# EasyEDA Pro project 四合一.epro, board PCB2
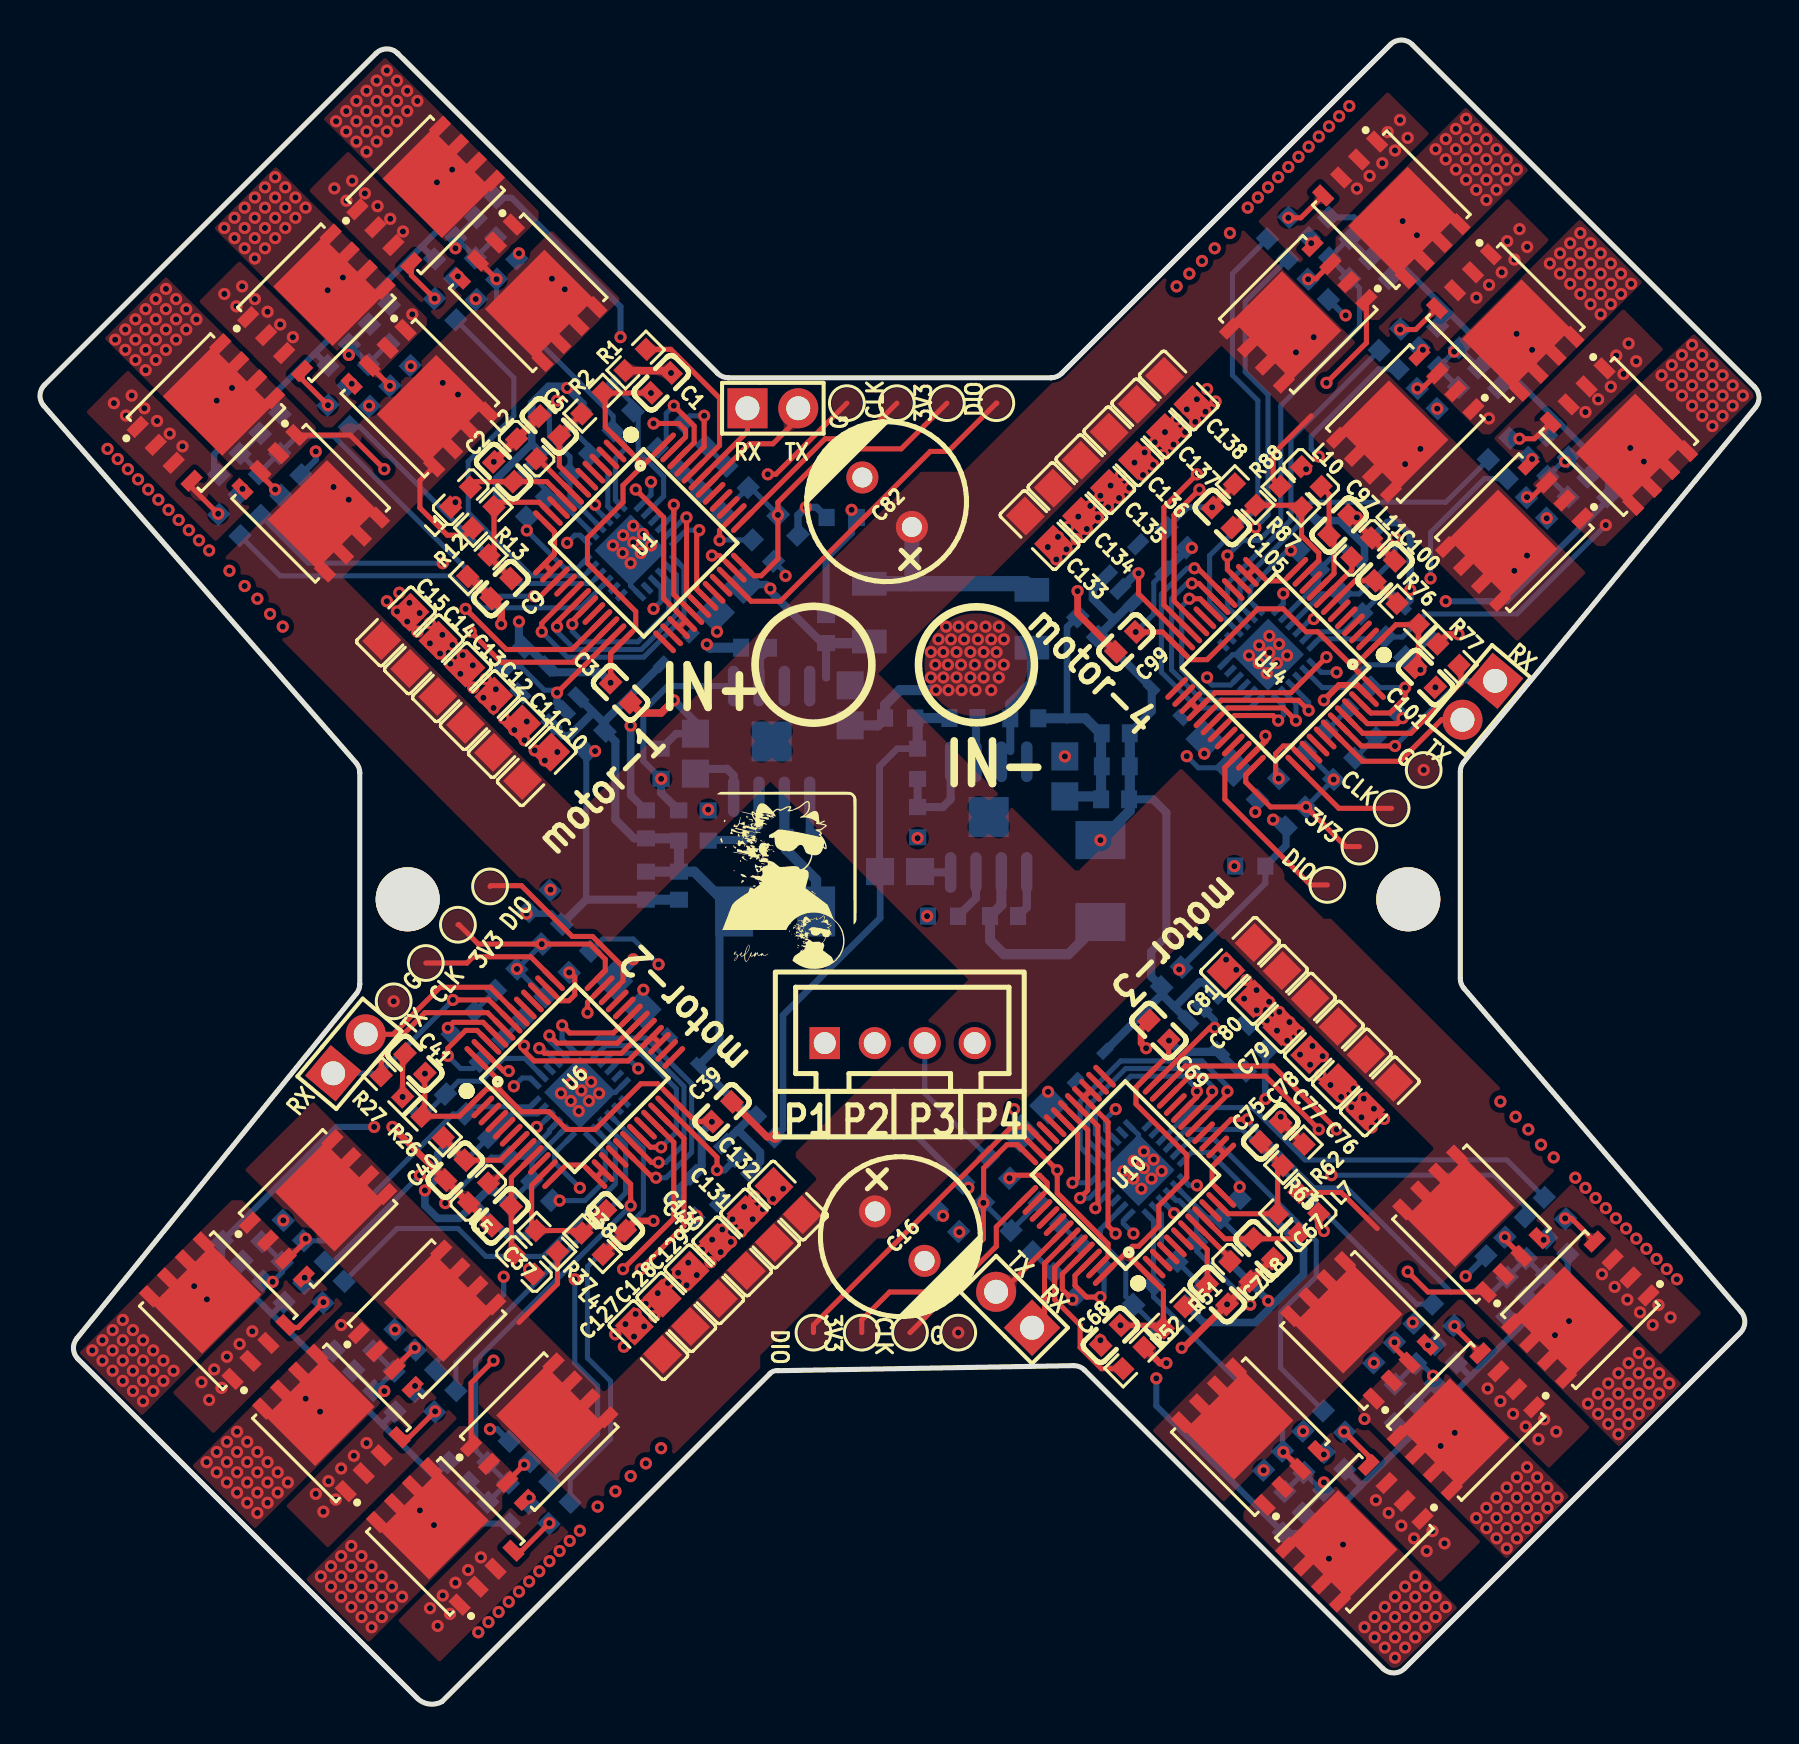
[diagram p5: board, top side]
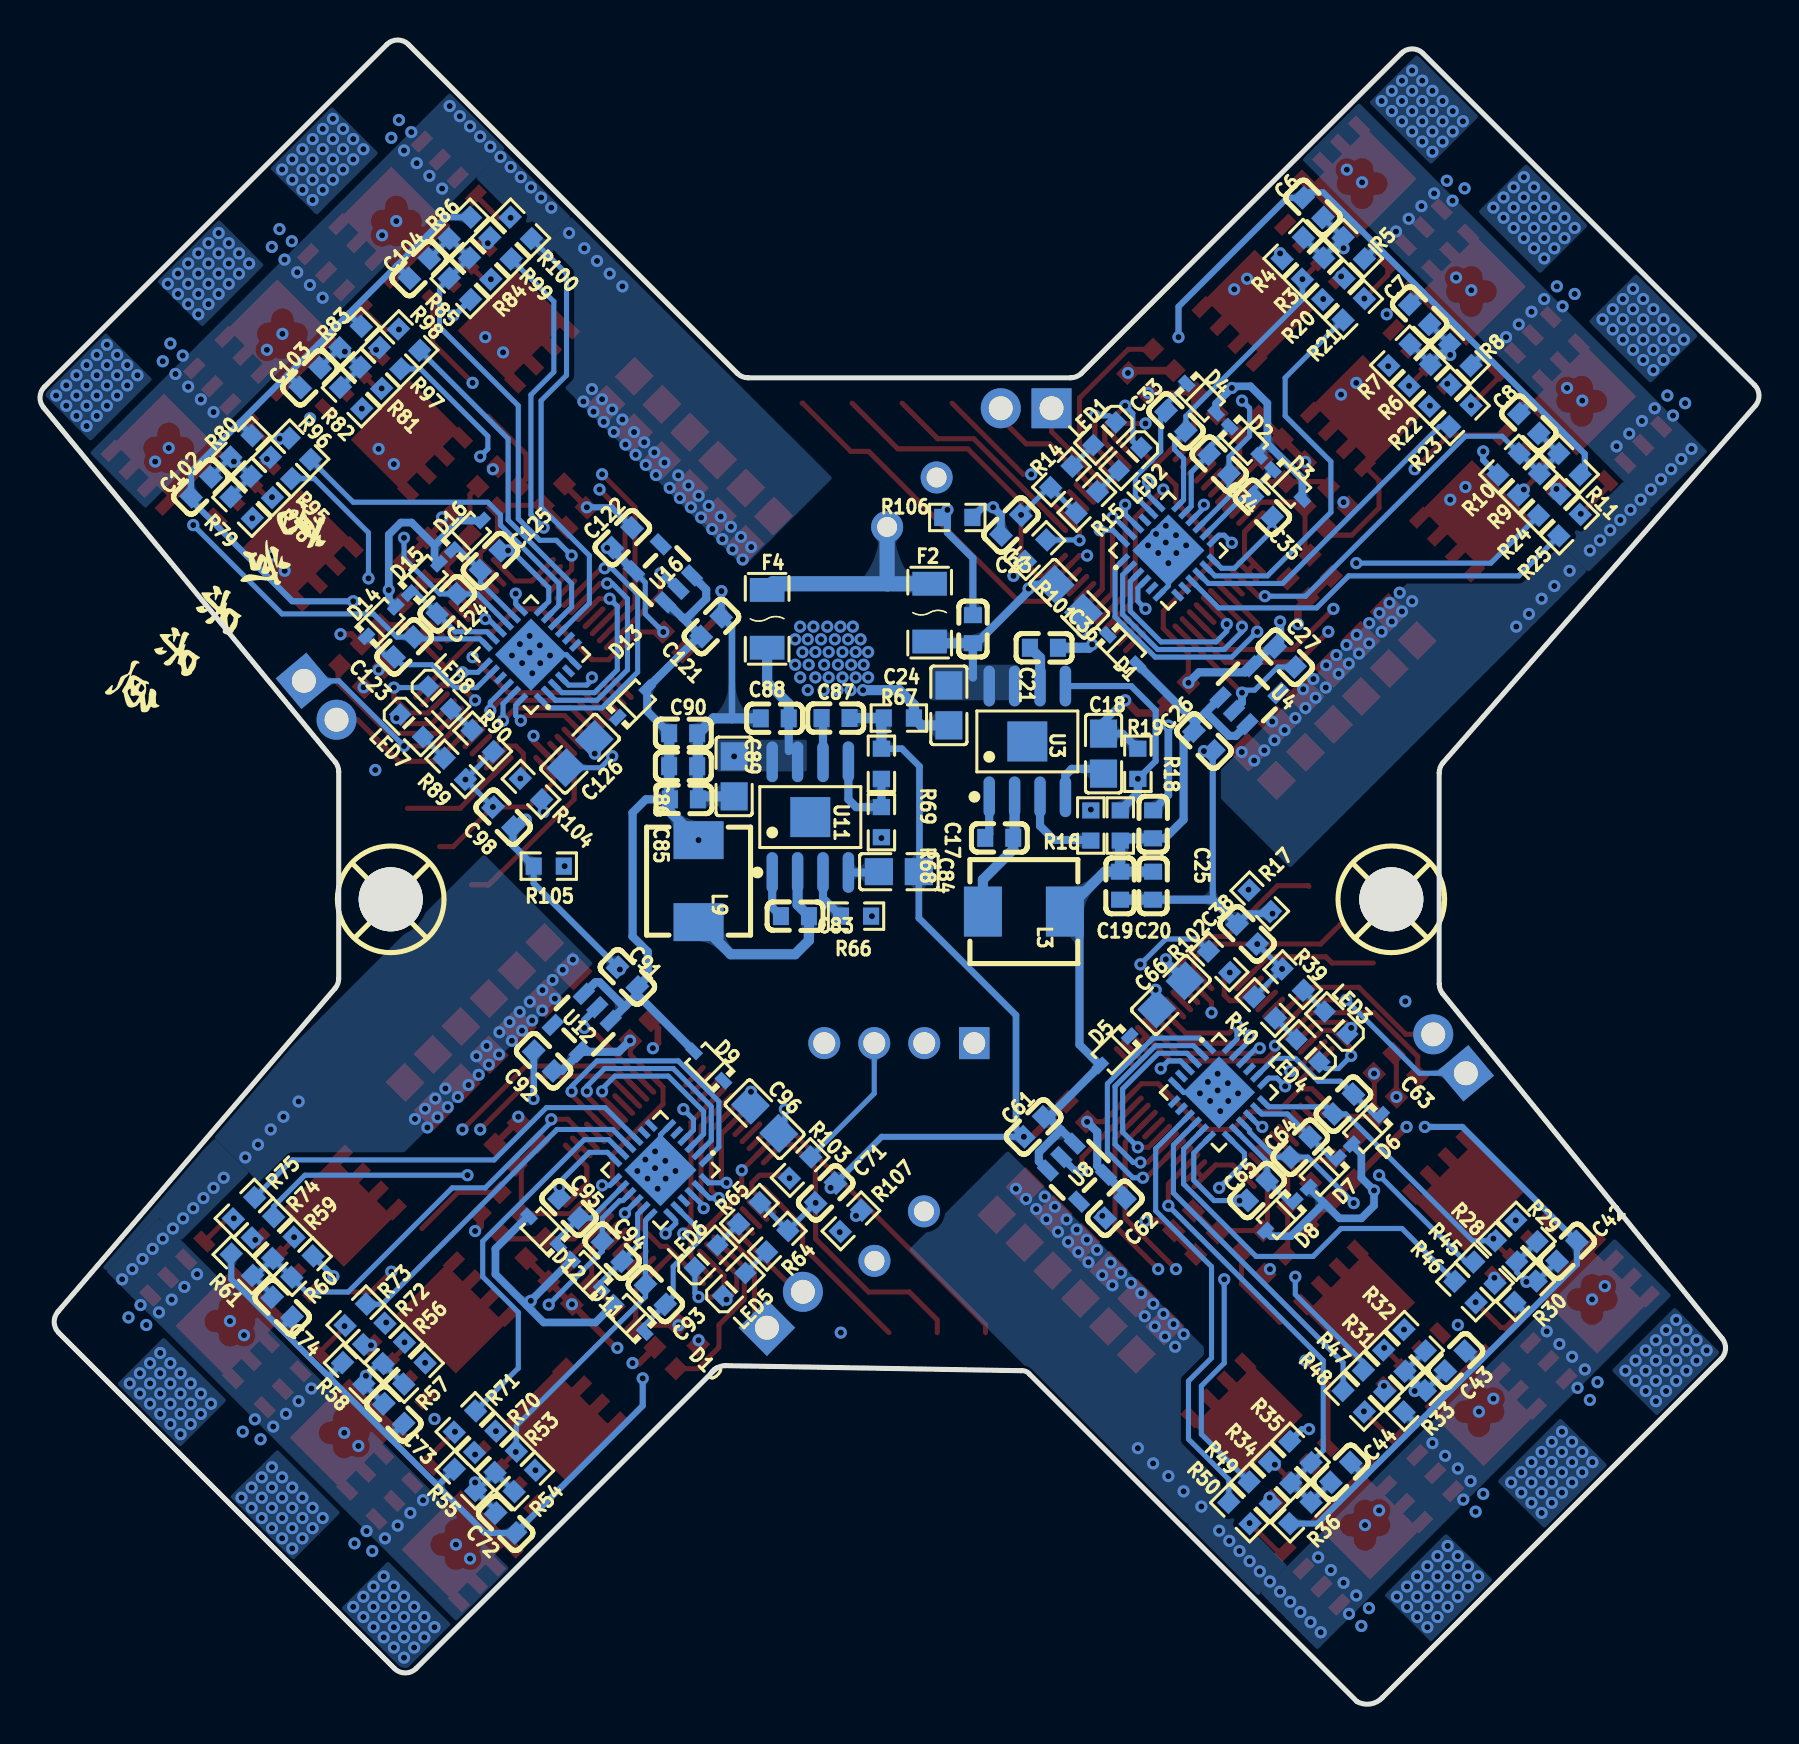
[diagram p6: board, bottom side, seen from below]

Outline 85.97 x 83.22 mm; copper layers: Top Layer, 电源层, 地层, Bottom Layer. Coordinates in mm from the lower left corner of the outline.
Outline path: 0.19,64.92 arc(0,65.45) 0.22,65.96 16.81,82.55 arc(17.35,82.77) 17.89,82.55 33.89,66.55 arc(34.14,66.38) 34.43,66.33 50.56,66.33 arc(50.85,66.38) 51.1,66.55 67.55,82.99 arc(68.09,83.22) 68.62,82.99 85.75,65.87 arc(85.97,65.37) 85.8,64.84 71.21,47.11 arc(71.08,46.88) 71.03,46.63 71.03,36.28 arc(71.08,36.02) 71.22,35.79 85.08,19.62 arc(85.27,19.09) 85.04,18.58 68.24,1.78 arc(67.7,1.55) 67.17,1.78 52.24,16.7 arc(52,16.86) 51.7,16.92 36.91,16.67 arc(36.68,16.64) 36.49,16.51 20.11,0.13 arc(19.44,0) 18.84,0.32 1.9,17.26 arc(1.67,17.76) 1.84,18.28 15.83,35.53 arc(15.95,35.76) 16,36.01 16,46.57 arc(15.95,46.84) 15.81,47.07 0.19,64.92
Stack: Top Layer 0.035mm 外层铜厚1oz / Dielectric1 0.2104mm 7628 RC49% 8.6mil / 电源层 0.0152mm 内层铜厚 / Dielectric2 1.065mm 1.1mm H/HOZ 含铜 / 地层 0.0152mm 内层铜厚 / Dielectric3 0.2104mm 7628 RC49% 8.6mil / Bottom Layer 0.035mm 外层铜厚1oz

## Design rules (mm)
template: 自定义配置
spacing copperThickness1oz (default): track to track 0.102, other pairs 0.152 to 0.3
spacing copperThickness2oz: track to track 0.203, other pairs 0.152 to 0.3
track width copperThickness1oz (default): min 0.127, default 0.254, max 2.54
track width copperThickness2oz: min 0.203, default 0.254, max 2.54
differential pair differentialPair (default): width min 0.127, default 0.254, max 2.54; gap min 0.152, default 0.152
via viaSize (default): diameter min 0.5, default 0.61, max 10; hole min 0.3, default 0.305, max 6.3
net VSA1 uses copperRegion1
net VSB1 uses copperRegion1
net VSC1 uses copperRegion1
net VCCBAT uses copperRegion1
net PGND uses copperRegion1
net 12V uses copperRegion1
net VSA2 uses copperRegion1
net VSB2 uses copperRegion1
net VSC2 uses copperRegion1
net VSA3 uses copperRegion1
net VSB3 uses copperRegion1
net VSC3 uses copperRegion1
net +12V uses copperRegion1
net VSA4 uses copperRegion1
net VSB4 uses copperRegion1
net VSC4 uses copperRegion1

## Placement (name value [footprint] x y rotation side)
C1  100nF  [C0603]  31.07 66.07 225 top
C2  100nF  [C0603]  23.19 61.63 315 top
C3  100nF  [C0603]  29.03 50.58 135 top
C4  100nF  [C0603]  37.42 58.96 315 bottom
C5  100nF  [c0603]  25.48 63.91 315 top
C6  100nF  [C0603]  22.3 74.83 225 bottom
C7  100nF  [C0603]  16.97 69.5 225 bottom
C8  100nF  [C0603]  11.51 64.04 225 bottom
C9  100nF  [C0603]  23.06 55.78 45 top
C10  22uF  [C0805]  24.84 46.89 225 top
C11  22uF  [C0805]  23.39 48.3 225 top
C12  22uF  [C0805]  21.99 49.7 225 top
C13  22uF  [C0805]  20.6 51.09 225 top
C14  22uF  [C0805]  19.2 52.49 225 top
C15  22uF  [C0805]  17.8 53.89 225 top
C16  470uF  [CAP-TH_BD8.0-P3.50-D0.6-FD]  43 23.4 315 top
C17  100nF  [C0603]  38 43.32 0 bottom
C18  10uF  [C0805]  32.78 47.53 270 bottom
C19  100pF  [C0603]  31.95 40.93 90 bottom
C20  10uF  [C0603]  30.3 40.93 90 bottom
C21  10uF  [C0603]  35.76 52.82 0 bottom
C23  100nF  [C0603]  39.32 53.75 270 bottom
C24  10uF  [C0805]  40.52 49.94 90 bottom
C25  220pF  [C0603]  30.3 43.99 270 bottom
C26  10uF  [C0603]  27.76 48.16 45 bottom
C27  10uF  [C0603]  23.7 52.36 45 bottom
C33  4.7uF  [C0603]  29.16 64.17 45 bottom
C34  4.7uF  [C0603]  27 62.01 45 bottom
C35  4.7uF  [C0603]  24.84 59.85 45 bottom
C36  22uF  [C0805]  34.49 55.28 45 bottom
C37  100nF  [C0603]  23.06 24.42 45 top
C38  100nF  [C0603]  25.6 38.5 225 bottom
C39  100nF  [C0603]  34.11 29.62 45 top
C40  100nF  [c0603]  20.78 26.7 45 top
C41  100nF  [C0603]  18.75 32.03 315 top
C42  100nF  [C0603]  9.6 22.64 315 bottom
C43  100nF  [C0603]  15.19 17.16 315 bottom
C44  100nF  [C0603]  20.91 11.58 315 bottom
C45  100nF  [C0603]  28.78 24.17 135 top
C61  10uF  [C0603]  36.27 28.86 135 bottom
C62  10uF  [C0603]  32.21 24.8 135 bottom
C63  4.7uF  [C0603]  20.78 30 135 bottom
C64  4.7uF  [C0603]  22.94 27.84 135 bottom
C65  4.7uF  [C0603]  25.1 25.69 135 bottom
C66  22uF  [C0805]  29.41 35.46 135 bottom
C67  100nF  [C0603]  61.16 22.77 135 top
C68  100nF  [C0603]  53.54 18.45 45 top
C69  100nF  [C0603]  55.96 33.69 135 top
C70  100nF  [c0603]  58.87 20.49 135 top
C71  100nF  [C0603]  46.69 25.56 315 bottom
C72  100nF  [C0603]  62.69 9.05 45 bottom
C73  100nF  [C0603]  68.28 14.52 45 bottom
C74  100nF  [C0603]  73.86 19.84 45 bottom
C75  100nF  [C0603]  61.55 28.61 225 top
C76  22uF  [C0805]  67.01 30.38 45 top
C77  22uF  [C0805]  65.61 31.78 45 top
C78  22uF  [C0805]  64.21 33.18 45 top
C79  22uF  [C0805]  62.82 34.58 45 top
C80  22uF  [C0805]  61.42 35.97 45 top
C81  22uF  [C0805]  60.02 37.37 45 top
C82  470uF  [CAP-TH_BD8.0-P3.50-D0.6-FD]  42.37 60.1 135 top
C83  100nF  [C0603]  48.22 39.4 0 bottom
C84  10uF  [C0805]  43.02 41.63 0 bottom
C85  100pF  [C0603]  53.77 45.24 0 bottom
C86  10uF  [C0603]  53.81 46.9 0 bottom
C87  10uF  [C0603]  46.19 49.31 0 bottom
C88  100nF  [C0603]  49.23 49.29 180 bottom
C89  10uF  [C0805]  51.26 46.39 90 bottom
C90  220pF  [C0603]  53.81 48.55 0 bottom
C91  10uF  [C0603]  56.59 36.35 225 bottom
C92  10uF  [C0603]  60.78 32.16 225 bottom
C93  4.7uF  [C0603]  55.2 20.48 225 bottom
C94  4.7uF  [C0603]  57.35 22.64 225 bottom
C95  4.7uF  [C0603]  59.51 24.8 225 bottom
C96  22uF  [C0805]  49.73 29.24 225 bottom
C97  100nF  [C0603]  64.97 58.96 225 top
C98  100nF  [C0603]  62.82 44.35 45 bottom
C99  100nF  [C0603]  54.31 53.12 225 top
C100  100nF  [c0603]  67.26 56.67 225 top
C101  100nF  [C0603]  69.29 51.34 135 top
C102  100nF  [C0603]  77.92 60.87 135 bottom
C103  100nF  [C0603]  72.46 66.33 135 bottom
C104  100nF  [C0603]  67 71.79 135 bottom
C105  100nF  [C0603]  59.14 59.33 315 top
C121  10uF  [C0603]  52.4 53.88 315 bottom
C122  10uF  [C0603]  56.86 58.32 315 bottom
C123  4.7uF  [C0603]  67.77 52.86 315 bottom
C124  4.7uF  [C0603]  65.61 55.02 315 bottom
C125  4.7uF  [C0603]  63.45 57.18 315 bottom
C126  22uF  [C0805]  58.96 47.53 315 bottom
C127  22uF  [C0805]  30.43 18.19 315 top
C128  22uF  [C0805]  31.83 19.59 315 top
C129  22uF  [C0805]  33.22 20.99 315 top
C130  22uF  [C0805]  34.62 22.38 315 top
C131  22uF  [C0805]  36.02 23.78 315 top
C132  22uF  [C0805]  37.42 25.18 315 top
C133  22uF  [C0805]  49.99 58.71 135 top
C134  22uF  [C0805]  51.39 60.1 135 top
C135  22uF  [C0805]  52.78 61.5 135 top
C136  22uF  [C0805]  54.18 62.9 135 top
C137  22uF  [C0805]  55.58 64.29 135 top
C138  22uF  [C0805]  56.95 65.69 135 top
CN2  ZX-XH2.54-4PZZ  [CONN-TH_4P-P2.50_4PIN]  43 33.05 0 top
D1  B5819WS  [SOD-323_L1.7-W1.3-LS2.5-FD]  31.83 52.74 45 bottom
D2  B5819WS  [SOD-323_L1.7-W1.3-LS2.5-FD]  25.73 63.15 45 bottom
D3  B5819WS  [SOD-323_L1.7-W1.3-LS2.5-FD]  23.57 60.99 45 bottom
D4  B5819WS  [SOD-323_L1.7-W1.3-LS2.5-FD]  27.89 65.31 45 bottom
D5  B5819WS  [SOD-323_L1.7-W1.3-LS2.5-FD]  32.21 32.67 135 bottom
D6  B5819WS  [SOD-323_L1.7-W1.3-LS2.5-FD]  19.64 28.73 135 bottom
D7  B5819WS  [SOD-323_L1.7-W1.3-LS2.5-FD]  21.79 26.57 135 bottom
D8  B5819WS  [SOD-323_L1.7-W1.3-LS2.5-FD]  23.95 24.42 135 bottom
D9  B5819WS  [SOD-323_L1.7-W1.3-LS2.5-FD]  52.53 31.91 225 bottom
D10  B5819WS  [SOD-323_L1.7-W1.3-LS2.5-FD]  56.47 19.34 225 bottom
D11  B5819WS  [SOD-323_L1.7-W1.3-LS2.5-FD]  58.62 21.49 225 bottom
D12  B5819WS  [SOD-323_L1.7-W1.3-LS2.5-FD]  60.78 23.65 225 bottom
D13  B5819WS  [SOD-323_L1.7-W1.3-LS2.5-FD]  56.34 50.07 315 bottom
D14  B5819WS  [SOD-323_L1.7-W1.3-LS2.5-FD]  68.91 54.13 315 bottom
D15  B5819WS  [SOD-323_L1.7-W1.3-LS2.5-FD]  66.75 56.29 315 bottom
D16  B5819WS  [SOD-323_L1.7-W1.3-LS2.5-FD]  64.59 58.45 315 bottom
F2  BSMD1206-150-16V  [F1206]  41.48 54.58 270 bottom
F4  BSMD1206-150-16V  [F1206]  49.61 54.27 270 bottom
H1  PZ254V-11-02P  [HDR-TH_2P-P2.54-V-M]  36.65 64.8 0 top
H2  PZ254V-11-02P  [HDR-TH_2P-P2.54-V-M]  15.48 32.52 50 top
H3  PZ254V-11-02P  [HDR-TH_2P-P2.54-V-M]  48.72 19.72 135 top
H4  PZ254V-11-02P  [HDR-TH_2P-P2.54-V-M]  71.96 50.2 230 top
L1  CBG160808U000T  [L0603]  21.03 60.36 225 top
L2  CBG160808U000T  [L0603]  24.33 62.77 315 top
L3  6.8uH  [IND-SMD_L5.4-W5.2_FXL0530]  36.77 39.63 0 bottom
L4  CBG160808U000T  [L0603]  24.21 21.99 315 top
L5  CBG160808U000T  [L0603]  21.93 25.56 45 top
L7  CBG160808U000T  [L0603]  63.46 24.03 45 top
L8  CBG160808U000T  [L0603]  60.02 21.63 135 top
L9  6.8uH  [IND-SMD_L5.4-W5.2_FXL0530]  53.04 41.15 270 bottom
L10  CBG160808U000T  [L0603]  63.58 61.38 135 top
L11  CBG160808U000T  [L0603]  66.11 57.82 225 top
LED1  XL-1608UGC-04  [LED0603-RD_GREEN]  32.73 63.53 315 bottom
LED2  XL-1608UGC-04  [LED0603-RD_GREEN]  31.46 62.26 315 bottom
LED3  XL-1608UGC-04  [LED0603-RD_GREEN]  21.16 34.07 45 bottom
LED4  XL-1608UGC-04  [LED0603-RD_GREEN]  22.56 32.67 45 bottom
LED5  XL-1608UGC-04  [LED0603-RD_GREEN]  51.26 20.99 135 bottom
LED6  XL-1608UGC-04  [LED0603-RD_GREEN]  52.66 22.38 135 bottom
LED7  XL-1608UGC-04  [LED0603-RD_GREEN]  67.39 48.93 225 bottom
LED8  XL-1608UGC-04  [LED0603-RD_GREEN]  65.99 50.32 225 bottom
Q1  AON6354  [DFN-8_L5.2-W6.1-P1.27-BL-EP]  24.42 70.57 225 top
Q2  AON6354  [DFN-8_L5.2-W6.1-P1.27-BL-EP]  19.29 75.47 315 top
Q3  AON6354  [DFN-8_L5.2-W6.1-P1.27-BL-EP]  19 65.31 225 top
Q4  AON6354  [DFN-8_L5.2-W6.1-P1.27-BL-EP]  13.82 70.07 315 top
Q5  AON6354  [DFN-8_L5.2-W6.1-P1.27-BL-EP]  13.54 60.05 225 top
Q6  AON6354  [DFN-8_L5.2-W6.1-P1.27-BL-EP]  8.3 64.59 315 top
Q7  AON6354  [DFN-8_L5.2-W6.1-P1.27-BL-EP]  13.91 24.79 315 top
Q8  AON6354  [DFN-8_L5.2-W6.1-P1.27-BL-EP]  8.92 19.67 45 top
Q9  AON6354  [DFN-8_L5.2-W6.1-P1.27-BL-EP]  19.35 19.27 315 top
Q10  AON6354  [DFN-8_L5.2-W6.1-P1.27-BL-EP]  14.57 14.06 45 top
Q11  AON6354  [DFN-8_L5.2-W6.1-P1.27-BL-EP]  24.97 13.62 315 top
Q12  AON6354  [DFN-8_L5.2-W6.1-P1.27-BL-EP]  20.27 8.38 45 top
Q13  AON6354  [DFN-8_L5.2-W6.1-P1.27-BL-EP]  60.53 13.37 45 top
Q14  AON6354  [DFN-8_L5.2-W6.1-P1.27-BL-EP]  65.74 8.54 135 top
Q15  AON6354  [DFN-8_L5.2-W6.1-P1.27-BL-EP]  65.99 18.68 45 top
Q16  AON6354  [DFN-8_L5.2-W6.1-P1.27-BL-EP]  71.32 14.13 135 top
Q17  AON6354  [DFN-8_L5.2-W6.1-P1.27-BL-EP]  71.59 24.01 45 top
Q18  AON6354  [DFN-8_L5.2-W6.1-P1.27-BL-EP]  77.04 19.72 135 top
Q19  AON6354  [DFN-8_L5.2-W6.1-P1.27-BL-EP]  73.74 58.58 135 top
Q20  AON6354  [DFN-8_L5.2-W6.1-P1.27-BL-EP]  78.97 63.38 225 top
Q21  AON6354  [DFN-8_L5.2-W6.1-P1.27-BL-EP]  68.28 64.04 135 top
Q22  AON6354  [DFN-8_L5.2-W6.1-P1.27-BL-EP]  73.28 69.09 225 top
Q23  AON6354  [DFN-8_L5.2-W6.1-P1.27-BL-EP]  62.93 69.5 135 top
Q24  AON6354  [DFN-8_L5.2-W6.1-P1.27-BL-EP]  67.59 74.73 225 top
R1  10kΩ  [R0603]  29.8 67.21 225 top
R2  10kΩ  [R0603]  27.64 65.06 45 top
R3  10kΩ  [R0603]  22.3 71.79 315 bottom
R4  1kΩ  [R0603]  23.32 72.8 315 bottom
R5  1kΩ  [R0603]  20.27 72.8 45 bottom
R6  10kΩ  [R0603]  16.97 66.45 315 bottom
R7  1kΩ  [R0603]  17.98 67.47 315 bottom
R8  1kΩ  [R0603]  14.94 67.47 45 bottom
R9  10kΩ  [R0603]  11.51 60.99 315 bottom
R10  1kΩ  [R0603]  12.52 62.01 315 bottom
R11  1kΩ  [R0603]  9.48 62.01 45 bottom
R12  47kΩ  [R0603]  22.18 59.34 45 top
R13  10kΩ  [R0603]  21.92 56.93 45 top
R14  1kΩ  [R0603]  34.89 61.37 315 bottom
R15  2.7kΩ  [R0603]  33.62 60.1 135 bottom
R16  100kΩ  [R0603]  33.42 43.93 90 bottom
R17  0Ω  [R0603]  24.97 40.16 45 bottom
R18  22kΩ  [R0603]  31.95 43.93 270 bottom
R19  3kΩ  [R0603]  31.07 47.02 270 bottom
R20  4.7Ω  [R0603]  21.29 70.77 315 bottom
R21  4.7Ω  [R0603]  20.27 69.75 315 bottom
R22  4.7Ω  [R0603]  15.95 65.44 315 bottom
R23  4.7Ω  [R0603]  14.94 64.42 315 bottom
R24  4.7Ω  [R0603]  10.49 59.98 315 bottom
R25  4.7Ω  [R0603]  9.48 58.96 315 bottom
R26  10kΩ  [R0603]  19.64 28.86 135 top
R27  10kΩ  [R0603]  17.6 30.89 315 top
R28  10kΩ  [R0603]  12.65 22.64 45 bottom
R29  1kΩ  [R0603]  11.63 23.65 45 bottom
R30  1kΩ  [R0603]  11.68 20.62 135 bottom
R31  10kΩ  [R0603]  18.24 17.18 45 bottom
R32  1kΩ  [R0603]  17.22 18.19 45 bottom
R33  1kΩ  [R0603]  17.22 15.14 135 bottom
R34  10kΩ  [R0603]  23.95 11.59 45 bottom
R35  1kΩ  [R0603]  22.94 12.6 45 bottom
R36  1kΩ  [R0603]  22.94 9.56 135 bottom
R37  47kΩ  [R0603]  25.35 23.15 135 top
R38  10kΩ  [R0603]  27.64 23.02 135 top
R39  1kΩ  [R0603]  23.32 36.23 45 bottom
R40  2.7kΩ  [R0603]  24.72 34.83 225 bottom
R45  4.7Ω  [R0603]  13.73 21.57 45 bottom
R46  4.7Ω  [R0603]  14.68 20.61 45 bottom
R47  4.7Ω  [R0603]  19.25 16.16 45 bottom
R48  4.7Ω  [R0603]  20.27 15.14 45 bottom
R49  4.7Ω  [R0603]  24.97 10.57 45 bottom
R50  4.7Ω  [R0603]  25.99 9.56 45 bottom
R51  10kΩ  [R0603]  56.72 19.34 225 top
R52  10kΩ  [R0603]  54.69 17.3 45 top
R53  10kΩ  [R0603]  62.68 12.11 135 bottom
R54  1kΩ  [R0603]  61.73 11.16 135 bottom
R55  1kΩ  [R0603]  64.72 11.21 225 bottom
R56  10kΩ  [R0603]  68.28 17.56 135 bottom
R57  1kΩ  [R0603]  67.25 16.53 135 bottom
R58  1kΩ  [R0603]  70.31 16.54 225 bottom
R59  10kΩ  [R0603]  73.8 22.81 135 bottom
R60  1kΩ  [R0603]  72.85 21.88 135 bottom
R61  1kΩ  [R0603]  75.88 21.97 225 bottom
R62  47kΩ  [R0603]  62.43 25.05 225 top
R63  10kΩ  [R0603]  62.69 27.46 225 top
R64  1kΩ  [R0603]  49.1 23.15 135 bottom
R65  2.7kΩ  [R0603]  50.5 24.54 315 bottom
R66  100kΩ  [R0603]  45.16 39.4 180 bottom
R67  0Ω  [R0603]  43.02 49.31 180 bottom
R68  22kΩ  [R0603]  43.89 44.1 270 bottom
R69  3kΩ  [R0603]  43.89 47.02 270 bottom
R70  4.7Ω  [R0603]  63.7 13.11 135 bottom
R71  4.7Ω  [R0603]  64.72 14.13 135 bottom
R72  4.7Ω  [R0603]  69.25 18.51 135 bottom
R73  4.7Ω  [R0603]  70.18 19.46 135 bottom
R74  4.7Ω  [R0603]  74.82 23.84 135 bottom
R75  4.7Ω  [R0603]  75.77 24.8 135 bottom
R76  10kΩ  [R0603]  68.41 54.51 315 top
R77  10kΩ  [R0603]  70.44 52.48 135 top
R78  10kΩ  [R0603]  74.88 60.86 225 bottom
R79  1kΩ  [R0603]  75.89 59.83 225 bottom
R80  1kΩ  [R0603]  75.9 62.9 315 bottom
R81  10kΩ  [R0603]  69.42 66.33 225 bottom
R82  1kΩ  [R0603]  70.41 65.31 225 bottom
R83  1kΩ  [R0603]  70.44 68.36 315 bottom
R84  10kΩ  [R0603]  63.96 71.79 225 bottom
R85  1kΩ  [R0603]  64.97 70.77 225 bottom
R86  1kΩ  [R0603]  64.97 73.82 315 bottom
R87  47kΩ  [R0603]  62.56 60.36 315 top
R88  10kΩ  [R0603]  60.28 60.48 315 top
R89  1kΩ  [R0603]  65.23 46.77 225 bottom
R90  2.7kΩ  [R0603]  63.83 48.16 45 bottom
R95  4.7Ω  [R0603]  73.91 61.82 225 bottom
R96  4.7Ω  [R0603]  72.98 62.77 225 bottom
R97  4.7Ω  [R0603]  68.46 67.3 225 bottom
R98  4.7Ω  [R0603]  67.51 68.23 225 bottom
R99  4.7Ω  [R0603]  62.94 72.8 225 bottom
R100  4.7Ω  [R0603]  61.93 73.82 225 bottom
R101  100Ω  [R0603]  36.16 57.68 315 bottom
R102  100Ω  [R0603]  27 37.12 45 bottom
R103  100Ω  [R0603]  47.96 26.83 135 bottom
R104  100Ω  [R0603]  61.42 45.75 225 bottom
R105  0Ω  [R0603]  60.53 41.9 180 bottom
R106  0Ω  [R0603]  40.1 59.34 0 bottom
R107  0Ω  [R0603]  45.42 24.16 135 bottom
TP1  -  [M3螺丝]  68.37 40.18 180 bottom
TP2  -  [M3螺丝]  18.33 40.18 180 bottom
U1  CH32V203C8T6  [LQFP-48_L7.0-W7.0-P0.50-LS9.0-BL]  30.18 58.07 225 top
U3  SY8205FCC  [SOIC-8_L5.0-W4.0-P1.27-LS6.0-BL-EP2.0]  36.59 48.14 180 bottom
U4  RT9013-33GB  [SOT-23-5_L2.9-W1.6-P0.95-LS2.8-BR]  25.48 50.45 315 bottom
U5  FD6288Q  [QFN-24_L4.0-W4.0-P0.50-BL-EP2.6]  29.54 57.69 225 bottom
U6  CH32V203C8T6  [LQFP-48_L7.0-W7.0-P0.50-LS9.0-BL]  26.75 31.27 315 top
U8  RT9013-33GB  [SOT-23-5_L2.9-W1.6-P0.95-LS2.8-BR]  34.11 26.57 45 bottom
U9  FD6288Q  [QFN-24_L4.0-W4.0-P0.50-BL-EP2.6]  27.01 30.59 315 bottom
U10  CH32V203C8T6  [LQFP-48_L7.0-W7.0-P0.50-LS9.0-BL]  54.31 26.45 45 top
U11  SY8205FCC  [SOIC-8_L5.0-W4.0-P1.27-LS6.0-BL-EP2.0]  47.45 44.35 180 bottom
U12  RT9013-33GB  [SOT-23-5_L2.9-W1.6-P0.95-LS2.8-BR]  58.88 34.07 135 bottom
U13  FD6288Q  [QFN-24_L4.0-W4.0-P0.50-BL-EP2.6]  54.94 26.7 45 bottom
U14  CH32V203C8T6  [LQFP-48_L7.0-W7.0-P0.50-LS9.0-BL]  61.8 51.85 135 top
U16  RT9013-33GB  [SOT-23-5_L2.9-W1.6-P0.95-LS2.8-BR]  54.81 56.55 225 bottom
U17  FD6288Q  [QFN-24_L4.0-W4.0-P0.50-BL-EP2.6]  61.42 52.48 135 bottom

## Footprints (pads in the part's own frame, mm; a bottom-side part is the same pattern mirrored in y, then rotated)
c0603
  rect 0.8x0.899 smd: 1(-0.701,0) 2(0.701,0)
C0603
  rect 0.8x0.9 smd: 1(-0.7,0) 2(0.7,0)
C0805
  rect 1.41x1.35 smd: 1(-1,0) 2(1,0)
CAP-TH_BD8.0-P3.50-D0.6-FD
  round 1.6 hole 1: 1(-1.75,0) 2(1.75,0)
CONN-TH_4P-P2.50_4PIN
  rect 1.524x1.6 hole 1.1: 1(-3.75,0)
  round 1.6 hole 1.1: 2(-1.25,0) 3(1.25,0) 4(3.75,0)
DFN-8_L5.2-W6.1-P1.27-BL-EP
  rect 0.574x1.016 smd: 1(-1.905,-2.918) 2(-0.635,-2.918) 3(0.635,-2.918) 4(1.905,-2.918) 5(1.905,2.918) 6(0.635,2.918) 7(-0.635,2.918) 8(-1.905,2.918)
  rect 4.2x3.5 smd: 9(0,0.8)
F1206
  rect 1.19x1.728 smd: 1(-1.445,0) 2(1.445,0)
HDR-TH_2P-P2.54-V-M
  rect 2x2 hole 1.2: 1(-1.27,0)
  round 2 hole 1.2: 2(1.27,0)
IND-SMD_L5.4-W5.2_FXL0530
  rect 1.9x2.5 smd: 1(-2.05,0) 2(2.05,0)
L0603
  rect 0.8x0.864 smd: 1(-0.7,0) 2(0.7,0)
LED0603-RD_GREEN
  rect 0.8x0.8 smd: 1(-0.799,-0.004) 2(0.799,0.004)
LQFP-48_L7.0-W7.0-P0.50-LS9.0-BL
  oval 0.27x1.5 smd: 1(-2.75,-4.25) 2(-2.25,-4.25) 3(-1.75,-4.25) 4(-1.25,-4.25) 5(-0.75,-4.25) 6(-0.25,-4.25) 7(0.25,-4.25) 8(0.75,-4.25) 9(1.25,-4.25) 10(1.75,-4.25) 11(2.25,-4.25) 12(2.75,-4.25) 25(2.75,4.25) 26(2.25,4.25) 27(1.75,4.25) 28(1.25,4.25) 29(0.75,4.25) 30(0.25,4.25) 31(-0.25,4.25) 32(-0.75,4.25) 33(-1.25,4.25) 34(-1.75,4.25) 35(-2.25,4.25) 36(-2.75,4.25)
  oval 1.5x0.27 smd: 13(4.25,-2.75) 14(4.25,-2.25) 15(4.25,-1.75) 16(4.25,-1.25) 17(4.25,-0.75) 18(4.25,-0.25) 19(4.25,0.25) 20(4.25,0.75) 21(4.25,1.25) 22(4.25,1.75) 23(4.25,2.25) 24(4.25,2.75) 37(-4.25,2.75) 38(-4.25,2.25) 39(-4.25,1.75) 40(-4.25,1.25) 41(-4.25,0.75) 42(-4.25,0.25) 43(-4.25,-0.25) 44(-4.25,-0.75) 45(-4.25,-1.25) 46(-4.25,-1.75) 47(-4.25,-2.25) 48(-4.25,-2.75)
M3螺丝
  round 3.2 hole 3.2: 1(-0.064,0.064)
QFN-24_L4.0-W4.0-P0.50-BL-EP2.6
  rect 0.28x0.665 smd: 1(-1.25,-1.907) 2(-0.75,-1.907) 3(-0.25,-1.907) 4(0.25,-1.907) 5(0.75,-1.907) 6(1.25,-1.907) 13(1.25,1.907) 14(0.75,1.907) 15(0.25,1.907) 16(-0.25,1.907) 17(-0.75,1.907) 18(-1.25,1.907)
  rect 0.665x0.28 smd: 7(1.907,-1.25) 8(1.907,-0.75) 9(1.907,-0.25) 10(1.907,0.25) 11(1.907,0.75) 12(1.907,1.25) 19(-1.907,1.25) 20(-1.907,0.75) 21(-1.907,0.25) 22(-1.907,-0.25) 23(-1.907,-0.75) 24(-1.907,-1.25)
  rect 2.55x2.55 smd: 25(0,0)
R0603
  rect 0.806x0.864 smd: 1(-0.753,0) 2(0.753,0)
SOD-323_L1.7-W1.3-LS2.5-FD
  rect 0.78x0.5 smd: 1(-1.04,0) 2(1.04,0)
SOIC-8_L5.0-W4.0-P1.27-LS6.0-BL-EP2.0
  oval 0.574x2.038 smd: 1(-1.905,-2.769) 2(-0.635,-2.769) 3(0.635,-2.769) 4(1.905,-2.769) 5(1.905,2.769) 6(0.635,2.769) 7(-0.635,2.769) 8(-1.905,2.769)
  rect 2x2 smd: 9(0,0)
SOT-23-5_L2.9-W1.6-P0.95-LS2.8-BR
  rect 1x0.6 smd: 1(1.1,-0.95) 2(1.1,0) 3(1.1,0.95) 4(-1.1,0.95) 5(-1.1,-0.95)

## Nets
As in the schematic.

Pads without a net: TP1 1; TP2 1; U1 2 3 4 5 6 10 16 20 25 26 32 33 39 40 41; U4 4; U5 5 7 8 21; U6 2 3 4 5 6 10 16 20 25 26 32 33 39 40 41; U8 4; U9 5 7 8 21; U10 2 3 4 5 6 10 16 20 25 26 32 33 39 40 41; U12 4; U13 5 7 8 21; U14 2 3 4 5 6 10 16 20 25 26 32 33 39 40 41; U16 4; U17 5 7 8 21

## Via types
v1: diameter 0.61, hole 0.305, Top Layer to Bottom Layer, 906 vias

## Routing (per net, layer and track width the routed paths; a pad name or vN(x,y) marks a point on that pad's centre or on a via; arc(x,y) is an arc through that point)
3V31: length 64.2
  Top Layer w0.254: 28.19,65.56 R2.2 ; 28.19,65.56 v1(30.56,65.56) ; 28.19,65.56 28.27,65.49 28.27,63.86 U1.1 30.17,61.97 30.17,61.95 ; v1(28.54,51.07) 28.54,52.54 U1.24 29.8,53.8 29.8,54.64 27.38,57.05 27.38,58.32 29.16,60.1 29.16,60.94 30.17,61.95 ; 45.36,65.06 43.07,62.77 39.57,62.77 36.91,60.1 v1(36.91,59.47) 36.91,57.26 36.07,56.42 35.71,56.42 U1.36 ; 30.17,61.95 U1.48
  电源层 w0.254: 23.95,54.26 23.95,56.93 v1(20.78,60.1) ; v1(30.56,65.56) 30.56,65.06 31.57,64.04 32.34,64.04 v1(36.91,59.47)
  Bottom Layer w0.254: C4.1 35.54,60.83 R14.2 R15.1
  Bottom Layer w0.406: v1(23.95,54.13) 23.95,53.09 C27.2 24.42,52.85 U4.5 25.68,51.59 28.02,51.59 28.53,51.09
3V32: length 60.4
  Top Layer w0.254: 33.62,29.13 32.78,29.13 U6.24 30.89,31.02 30.05,31.02 27.76,28.73 26.34,28.73 25.45,29.62 24.08,29.62 22.94,30.77 ; 20.9,38.97 20.95,38.97 21.92,38 v1(25.1,38) 27.51,38 28.27,37.24 28.27,36.69 U6.36 ; C41.2 19.24,29.54 R26.2 20.98,29.39 U6.1 22.35,30.77 22.94,30.77 ; 22.94,30.77 22.94,31.19 U6.48
  电源层 w0.254: v1(24.46,21.75) 24.46,22.38 30.81,28.73 33.22,28.73 v1(33.61,29.11) ; v1(19.25,31.53) 21.16,31.53 23.85,34.22 v1(23.85,36.76)
  Bottom Layer w0.254: C38.2 v1(23.85,36.76) R39.2 R40.1
  Bottom Layer w0.406: C62.2 31.71,25.52 U8.5 33.1,26.9 33.1,28.61 v1(33.61,29.11)
5V: length 41.5
  Bottom Layer w0.406: L3.1 33.99,38.9 33.99,32.98 D5.1 35.54,29.34 ; 28.26,49.01 28.26,49.17 D1.1 ; 28.26,49.01 C26.2 28.78,48.14 28.78,44.23 29.72,43.29 C25.2 ; 28.26,49.01 U4.1 ; U4.3 26.17,48.42 26.49,48.42 27.67,49.6 ; 35.54,29.34 35.64,29.24 35.66,29.24 C61.2 35.55,29.36 35.54,29.34 ; 35.54,29.34 34.9,28.71 ; 34.9,28.71 34.9,28.71 36.02,27.59 36.02,27.14 U8.3 ; 34.9,28.71 U8.1
  Bottom Layer w0.508: C19.2 31.95,43.17 R18.2 31.84,43.29 C25.2 ; C19.2 C20.2 ; C19.2 32.72,41.63 L3.1
12V: length 95.4
  电源层 w0.254: v1(29.67,37.24) 31.57,35.34 31.57,33.43 v1(29.92,31.78) 29.29,32.42 26.24,32.42 19.51,25.69 v1(19.25,25.69)
  电源层 w0.381: v1(26.37,65.82) 26.62,65.56 26.62,58.83 v1(30.68,54.77) 31.07,54.39 35.35,54.39 36.53,55.56 v1(36.53,55.78)
  电源层 w0.406: v1(29.67,37.24) 29.67,40.98 v1(33.42,44.73) 35.35,46.66 35.35,54.39
  Bottom Layer w0.254: v1(30.68,54.77) 31.07,55.15 31.07,55.81 U5.4 ; v1(29.92,31.78) 29.54,32.16 28.94,32.16 U9.4
  Bottom Layer w0.381: D6.1 19.89,27.52 19.89,26.32 v1(19.25,25.69) 19.25,24.92 19.89,24.29 20.98,24.29 21.75,25.06 ; 21.75,25.06 D7.1 ; 21.75,25.06 23.41,23.4 24.41,23.4 D8.1 ; D2.1 25,62.62 24.59,63.02 ; 24.59,63.02 22.84,61.27 D3.1 ; 24.59,63.02 24.59,65.06 25.43,65.9 26.29,65.9 27.15,65.03 D4.1 ; 35.2,55.98 36.33,55.98 v1(36.53,55.78)
  Bottom Layer w0.406: v1(29.67,37.24) 29.67,37.13 28.71,36.17 ; v1(36.53,55.78) 36.53,55.66 39.13,53.05 C23.2 39.32,51.34 39.32,51.34
  Bottom Layer w0.508: 41.48,53.14 41.4,53.05 C23.2
+3V33: length 71
  Top Layer w0.254: v1(47.18,25.06) 47.18,23.26 44.53,20.61 42.5,20.61 41.1,19.21 41.1,18.57 ; v1(54.04,18.94) 56.05,18.94 R51.2 56.19,20.68 U10.1 54.31,22.56 ; 52.78,21.03 U10.48 54.31,22.56 ; 56.45,33.19 56.45,32.48 U10.24 54.81,30.84 54.81,30 57.35,27.46 57.35,26.32 55.96,24.92 55.96,23.91 54.94,22.89 54.64,22.89 54.31,22.56 ; 47.19,25.05 47.19,26.8 48.36,27.97 48.89,27.97 U10.36
  Top Layer w0.381: L7.2 63.96,23.91 v1(64.21,23.65)
  电源层 w0.254: v1(47.18,25.06) 47.18,23.79 52.02,18.95 54.05,18.95
  电源层 w0.33: v1(64.21,23.65) 59.64,28.23 59.64,29.44 60.15,29.95 60.15,31.02 57.99,33.18 v1(56.47,33.18)
  Bottom Layer w0.254: v1(47.18,25.06) R64.2 R65.1
  Bottom Layer w0.406: v1(56.47,33.18) 57.03,32.62 58.93,32.62 59.88,31.67 60.29,31.67
+3V34: length 54.4
  Top Layer w0.254: 65.68,51.85 63.91,53.63 63.32,53.63 62.18,54.77 60.91,54.77 58.37,52.23 57.53,52.23 U14.24 56.15,53.61 v1(54.8,53.61) ; 65.68,51.85 U14.48 ; 65.68,51.85 65.69,51.85 U14.1 67.82,53.98 R76.2 68.94,51.98 68.8,51.84 ; U14.36 60.3,46.46 60.3,46.1 61.55,44.86 v1(63.32,44.86) 65.31,42.88 65.99,42.88
  电源层 w0.254: v1(64.7,46.23) 66.63,48.16 66.63,50.83 67.51,51.72 69.17,51.72 ; v1(63.32,61.75) 61.55,61.75 v1(57.61,57.82)
  Bottom Layer w0.254: R90.1 v1(64.7,46.23) 63.31,44.85 ; U16.5 55.7,56.09 55.7,54.51 v1(54.8,53.61)
  Bottom Layer w0.406: U16.5 57.35,57.74 C122.2
  vias: v1(69.04,51.72)
+5V: length 48.4
  电源层 w0.406: v1(43.89,43.31) 44.88,42.32 52.15,42.32 53.03,43.2 v1(53.04,43.2)
  Bottom Layer w0.406: 56.1,35.5 56.1,35.48 D9.1 ; 56.1,35.5 56.71,34.89 ; 56.1,35.5 C91.2 55.58,36.38 55.58,37.62 56.34,38.39 56.34,44.58 55.67,45.24 C85.2 ; U12.1 56.71,34.89 ; 56.71,34.89 56.78,34.89 57.99,36.1 58.19,36.1 58.77,35.52 ; 53.84,54.32 52.9,53.38 53.02,53.38 D13.1 55.6,49.64 C90.2 ; 53.84,54.32 53.61,54.32 52.66,55.28 52.66,55.73 U16.3 ; 53.84,54.32 54.61,55.1 54.71,55.1
  Bottom Layer w0.508: v1(53.04,43.2) 54.51,44.67 C86.2 C90.2
+12V: length 109.6
  电源层 w0.254: v1(57.35,47.4) 57.35,50.32 v1(58.37,51.34) 61.93,54.9 67.64,54.9 68.45,55.71 v1(68.53,55.71) ; 46.05,37.75 45.54,37.24 45.54,31.27 47.07,29.75 v1(48.72,29.75) v1(53.8,29.75) 55.07,29.75 61.43,23.39 v1(61.43,20.16)
  电源层 w0.381: v1(51.26,47.39) 57.34,47.39 v1(57.35,47.4) 57.35,43.72 51.39,37.75 46.05,37.75 44.4,39.4 v1(44.37,39.4)
  Bottom Layer w0.254: U17.4 59.54,50.96 58.62,50.96 58.37,51.21 v1(58.37,51.34) ; v1(57.35,47.4) 57.93,46.82 C126.2 ; v1(53.8,29.75) 53.29,29.24 53.29,28.71 U13.4 ; C96.2 48.72,28.84 v1(48.72,29.75)
  Bottom Layer w0.381: D15.1 66.24,57.25 66.24,57.94 ; D10.1 58.19,19.08 60.78,19.08 61.64,19.94 ; 66.24,57.94 67.39,59.08 67.92,59.08 68.53,58.48 v1(68.53,55.71) 68.53,55.22 D14.1 ; 66.24,57.94 65,59.19 D16.1 ; D12.1 61.57,24.39 63.2,22.76 63.2,21.49 61.64,19.94 ; D11.1 61.64,19.95 61.64,19.94
  Bottom Layer w0.406: C88.2 48.53,47.66
  Bottom Layer w0.508: F4.2 49.61,51.09 48.53,50.01 C88.2
GND: length 385.3
  Top Layer w0.254: v1(36.4,61.5) 36.8,61.5 40.36,65.06 ; 52.89,21.85 53.42,22.38 53.42,23.02 50.88,25.56 v1(50.88,26.69) U10.35 ; v1(54.94,56.55) 54.94,55.52 U14.23 ; v1(33.61,57.44) 33.99,57.44 U1.35 ; v1(18.14,30.36) 18.14,32.4 C41.1 ; U6.35 27.38,35.09 v1(27.38,34.58) ; v1(25.86,50.58) 25.87,50.58 U1.23 ; v1(33.86,26.7) 33.86,27.34 U6.23 ; 55.72,31.04 58.49,33.81 v1(58.75,33.81) ; v1(30.68,64.04) 31.95,64.04 32.29,63.71 32.29,63.36 31.59,62.67 ; v1(23.45,31.65) 23.18,31.65 22.15,32.69
  Top Layer w0.305: v1(65.86,59.34) 65.75,59.45 C97.1 L11.1 67.74,57.17 C100.1 ; R77.2 70.4,53.5 v1(70.94,53.5) ; U14.35 61.29,48.16 v1(61.29,48.42) ; R88.1 59.74,60.97 v1(58.62,59.85) ; v1(64.21,50.2) 64.97,50.96 65.87,50.96 66.4,50.43
  Top Layer w0.33: v1(56.34,17.05) 56.01,17.05 R52.2 ; v1(30.68,24.16) 29.76,24.16 C45.1 29.27,23.59 R38.1 ; R63.1 62.12,29.1 62.04,29.1 ; v1(51.89,55.66) 51.89,54.54 C99.2 ; 17.6,28.86 v1(17.63,28.86) C40.1 C37.1 ; v1(57.1,17.81) 57.19,17.81 v1(59.37,19.99) L8.1 61.66,22.28 ; v1(55.32,32.8) 55.07,33.05 55.07,33.79 55.46,34.18
  Top Layer w0.355: v1(36.77,28.37) 36.36,28.37 34.61,30.12
  Top Layer w0.381: 29.53,50.08 30.05,49.56 31.07,49.56 v1(31.7,50.2) ; v1(22.7,62.12) L2.1 24.98,64.41 ; v1(31.56,66.57) 31.44,66.68 R1.2 ; v1(23.06,54.01) 23.06,54.79 C9.1 21.46,56.39 R13.1
  地层 w0.254: v1(58.75,33.81) 58.12,33.18 58.12,33.05 ; v1(45.92,18.57) 45.92,20.9 49.73,24.71 ; v1(69.2,46.71) 66.43,46.71 64.47,48.67 ; 22.05,34.58 18.25,34.58 v1(17.69,35.14)
  地层 w0.305: v1(69.79,50.85) 69.79,52.74
  地层 w0.33: v1(33.35,52.99) 32.59,53.75 32.34,53.75 ; 33.61,27.97 34,28.37 v1(36.77,28.37) ; 48.08,25.43 47.7,25.81 v1(46.43,25.81) ; v1(51.89,55.66) 52.27,56.04 53.8,56.04 ; v1(24.33,39.53) 23.83,39.02 23.83,38 25.48,36.35 ; v1(45.98,23.6) 48.03,23.6 48.21,23.78 ; v1(31.7,50.2) 30.05,51.85 30.05,51.97 ; v1(32.84,24.42) 32.84,26.32 32.46,26.7 ; v1(29.54,48.93) 28.53,49.94 28.4,49.94
  地层 w0.355: v1(61.67,44.23) 61.67,44.61 62.69,45.62
  地层 w0.381: v1(23.06,54.01) 23.06,55.02 23.32,55.28 ; v1(25.86,50.58) 27,51.72 ; 28.78,49.31 28.78,48.67 v1(27.76,47.66)
  地层 w0.508: 57.35,34.19 56.97,34.58 v1(56.97,36.73)
  Bottom Layer w0.254: v1(25.86,50.58) 25.73,50.7 25.22,50.7 24.07,51.86 C27.1
  Bottom Layer w0.305: v1(61.67,44.23) 61.95,44.23 62.32,43.86 ; 16.84,70.64 16.84,70.62 C7.1 ; 16.84,70.64 19.07,72.87 ; 16.84,70.64 13.7,67.5 ; R86.1 65.71,74.35 68.14,71.93 ; 27.32,40.23 27.32,47.21 v1(27.76,47.66) ; 73.55,66.52 75.98,64.08 ; 73.55,66.52 73.55,66.42 C103.1 ; 73.55,66.52 70.51,69.55 ; 75.98,64.08 75.98,64.05 R80.1 ; 75.98,64.08 78.42,61.65 C102.1 78.42,60.21 73.36,55.15 v1(70.31,55.15) ; v1(16.71,28.86) 14.84,28.86 C42.1 9.11,21.99 11.61,19.49 ; v1(36.77,28.37) 43.88,28.37 v1(46.43,25.81) ; R8.1 13.84,67.5 13.7,67.5 ; 14.08,17.01 11.61,19.49 ; 14.08,17.01 17.15,13.94 ; 14.08,17.01 14.08,17.04 C43.1 ; 11.61,19.49 11.61,19.49 R30.1 ; R58.1 71.54,16.38 71.54,16.38 ; R33.1 17.15,14.01 17.15,13.94 ; 11.34,65.14 11.4,65.14 C8.1 ; 11.34,65.14 8.71,62.52 8.71,61.7 R11.1 ; 11.34,65.14 13.7,67.5 ; C122.1 57.39,59.85 v1(58.62,59.85) ; 17.15,13.94 19.7,11.39 ; 70.51,69.55 70.51,69.5 R83.1 ; 70.51,69.55 68.14,71.93 ; v1(55.83,16.29) 55.83,14.92 C72.1 63.72,8.55 66.06,10.89 ; 68.14,71.93 68.12,71.93 C104.1 ; 66.06,10.89 66.06,10.93 R55.1 ; 66.06,10.89 68.44,13.28 ; 71.54,16.38 73.92,18.75 ; 71.54,16.38 68.44,13.28 ; C74.1 73.92,18.8 73.92,18.75 ; 19.7,11.39 19.73,11.39 C44.1 ; 19.7,11.39 22.07,9.02 R36.1 ; 73.92,18.75 76.41,21.25 R61.1 ; v1(29.03,68.36) 29.03,69.88 23.59,75.33 22.8,75.33 22.53,75.6 21.79,75.6 19.07,72.87 ; 68.44,13.28 68.44,13.37 C73.1 ; 19.07,72.87 19.13,72.87 R5.1 ; R105.1 61.28,41.04 v1(56.97,36.73)
  Bottom Layer w0.33: 51.37,49.29 51.37,53.86 51.89,54.39 ; 51.89,54.39 v1(51.89,55.66) ; 51.89,54.39 51.91,54.37 ; U12.2 58.75,34.19 v1(58.75,33.81) ; C38.1 25.57,39.53 v1(24.33,39.53) ; 61.28,32.66 61.28,30.27 v1(61.29,30.26) ; v1(36.77,28.37) 37.16,28.76 37.16,34.45 42.02,39.31 C84.1 41.99,41.66 41.99,46.89 42.87,47.77 R69.1 ; U8.2 34.24,26.7 v1(33.86,26.7)
  Bottom Layer w0.355: 62.32,43.86 62.32,42.94 R105.1 ; R106.1 38.84,59.85 v1(38.3,59.85)
  Bottom Layer w0.381: U4.2 25.86,50.07 v1(25.86,50.58) ; v1(31.7,50.2) 32.78,49.11 C18.1 31.82,48.53 R19.1 ; v1(38.3,59.85) 37.91,59.45 C4.2 ; v1(29.54,48.93) 29.54,45.45 C25.1
  Bottom Layer w0.406: C20.1 27.32,40.23 C38.1
  Bottom Layer w0.432: U16.2 54.81,56.55 v1(54.94,56.55)
  Bottom Layer w0.508: C87.1 45.48,49.31 R67.1 ; 53.07,48.51 52.29,49.29 C88.1 ; 53.07,48.51 C85.1 52.92,45.39 C89.1 ; 53.07,48.51 C90.1 ; v1(33.35,52.99) 33.52,52.82 C21.1 ; C19.1 C20.1 ; R69.1 43.89,49.19
  vias: v1(53.04,18.19) v1(62.05,29.37)
PGND: length 98.8
  地层 w0.33: v1(45.16,24.42) 43.77,25.81 43.77,26.19
  地层 w0.355: v1(40.59,59.72) 43.26,57.05 43.26,56.8
  地层 w0.381: v1(55.17,61.46) 58.62,58.01 58.62,54.28 v1(60.47,52.44) ; v1(55.21,27.64) 57.45,29.88 59.87,29.88 62.48,32.48 v1(63.02,32.48) ; v1(33.11,22.71) 30.05,25.78 30.05,28.45 v1(27.96,30.54)
  地层 w0.406: v1(50.42,30.62) 46.92,30.62 44.91,28.61 ; v1(33.86,53.63) 39.19,53.63 40.72,55.15 ; v1(58.23,47.53) 58.23,45.86 57.23,44.86
  地层 w0.508: v1(29.54,57.05) 29.54,55.66 24.63,50.75 v1(22.8,50.75)
  地层 w0.635: C16.2 39.8,22.16 39.32,22.64 ; C82.2 45.96,61.34 47.07,60.23
  Bottom Layer w0.254: U9.6 28.78,30.59 U9.25 ; U17.6 59.65,52.48 U17.25 ; U13.25 54.94,28.47 U13.6 ; U5.25 v1(29.54,57.05) 29.54,55.92 U5.6
  Bottom Layer w0.355: C23.1 39.32,57.3 40.59,58.58 v1(40.59,59.72)
  Bottom Layer w0.381: 30.12,34.76 30.18,34.81 v1(30.18,35.72)
  Bottom Layer w0.508: C24.1 41.9,48.94 R67.2 42.27,49.97 43,50.7 v1(44.81,50.7) ; 33.79,54.57 33.86,54.5 v1(33.86,53.63)
  vias: v1(3.38,62.77) v1(3.7,65.06) v1(3.89,62.26) v1(4.3,64.44) v1(4.4,61.75) v1(4.59,65.44) v1(4.9,61.25) v1(5.22,64.8) v1(5.41,60.74) v1(5.86,64.17) v1(5.92,60.23) v1(6.49,63.53) v1(6.43,59.72) v1(6.94,59.21) v1(7.13,62.9) v1(7.44,58.71) v1(7.95,58.2) v1(8.08,16.1) v1(8.46,57.69) v1(8.46,15.21) v1(8.71,16.73) v1(9.08,15.81) v1(9.22,70.52) v1(9.35,17.37) v1(9.48,56.67) v1(9.83,69.9) v1(9.98,18) v1(10.11,70.9) v1(10.24,55.91) v1(10.62,18.64) v1(10.75,70.26) v1(10.87,55.28) v1(11.38,69.63) v1(11.51,54.51) v1(12.02,68.99) v1(12.14,53.88) v1(12.65,68.36) v1(13.79,10.51) v1(14.17,9.62) v1(14.43,11.14) v1(14.72,75.8) v1(14.79,10.22) v1(15.06,11.78) v1(15.33,75.18) v1(15.61,76.18) v1(15.7,12.41) v1(16.25,75.54) v1(16.33,13.05) v1(16.88,74.91) v1(17.35,55.15) v1(17.52,74.27) v1(17.86,54.64) v1(17.97,55.58) v1(18.15,73.64) v1(18.37,54.13) v1(18.48,55.07) v1(18.87,53.63) v1(18.99,54.56) v1(19.5,54.05) v1(19.5,53.04) v1(19.51,4.79) v1(19.89,3.9) v1(20.01,52.54) v1(20.12,53.47) v1(20.14,5.43) v1(20.51,4.51) v1(20.52,52.03) v1(20.63,52.96) v1(20.78,6.06) v1(21.02,51.52) v1(21.14,52.45) v1(21.41,6.7) v1(21.65,51.95) v1(21.67,50.83) v1(21.92,3.59) v1(22.05,7.33) v1(22.18,50.32) v1(22.29,51.26) v1(22.43,4.1) v1(22.68,49.82) v1(22.94,4.6) v1(23.19,49.31) v1(23.45,5.11) v1(23.72,48.71) v1(23.95,5.62) v1(24.23,48.2) v1(24.35,49.13) v1(24.46,6.13) v1(24.74,47.69) v1(24.97,6.64) v1(25.25,47.18) v1(25.48,7.14) v1(25.53,40.73) v1(25.87,47.61) v1(25.99,7.65) v1(26.06,30.54) v1(26.49,8.16) v1(26.56,31.05) v1(26.55,30.16) v1(26.95,29.65) v1(27,8.67) v1(27.07,31.52) v1(27.07,30.68) v1(27.45,30.16) v1(27.56,31.11) v1(27.89,9.87) v1(28.65,57.94) v1(28.77,18.49) v1(28.78,10.64) v1(29.16,58.45) v1(29.14,57.56) v1(29.2,17.87) v1(29.28,19) v1(29.54,11.4) v1(29.67,58.92) v1(29.67,58.09) v1(29.79,19.51) v1(29.71,18.38) v1(30.05,57.56) v1(30.16,58.51) v1(30.3,20.01) v1(30.22,18.88) v1(30.3,12.03) v1(30.56,57.94) v1(30.72,19.39) v1(30.9,20.55) v1(31.07,12.79) v1(31.41,21.06) v1(31.91,21.56) v1(32.34,20.94) v1(32.42,22.07) v1(32.85,21.45) v1(33.54,22.09) v1(33.62,23.22) v1(34.04,22.6) v1(34.13,23.73) v1(34.55,23.11) v1(34.63,24.24) v1(35.06,23.62) v1(35.22,24.87) v1(35.64,24.24) v1(35.72,25.37) v1(36.15,24.75) v1(36.66,25.26) v1(37.17,25.77) v1(44.56,52.61) v1(44.56,51.34) v1(44.78,51.97) v1(44.94,53.24) v1(45.18,52.61) v1(45.18,51.34) v1(45.32,53.88) v1(45.41,51.97) v1(45.43,50.7) v1(45.56,53.24) v1(45.84,52.61) v1(45.84,51.34) v1(45.94,53.88) v1(46.06,51.97) v1(46.09,50.7) v1(46.22,53.24) v1(46.6,53.88) v1(46.53,52.61) v1(46.53,51.34) v1(46.76,51.97) v1(46.78,50.7) v1(46.91,53.24) v1(47.19,52.61) v1(47.19,51.34) v1(47.29,53.88) v1(47.58,53.24) v1(47.53,51.97) v1(47.58,50.7) v1(47.84,52.6) v1(47.96,53.88) v1(47.96,51.34) v1(48.21,51.97) v1(48.21,53.24) v1(50.4,57.86) v1(50.83,57.24) v1(50.91,58.37) v1(51.34,57.75) v1(51.42,58.88) v1(51.85,58.25) v1(51.93,59.38) v1(52.36,58.76) v1(52.53,59.92) v1(52.91,59.34) v1(53.04,60.43) v1(53.42,59.85) v1(53.54,60.93) v1(53.97,60.31) v1(54.05,61.44) v1(54.19,26.66) v1(54.48,60.82) v1(54.7,27.16) v1(54.68,26.27) v1(54.74,62.08) v1(55.08,25.77) v1(55.25,62.59) v1(55.21,26.8) v1(55.59,26.27) v1(55.68,61.97) v1(55.7,27.23) v1(55.76,63.1) v1(56.1,26.66) v1(56.18,62.48) v1(56.26,63.61) v1(56.69,62.99) v1(56.85,70.9) v1(56.85,64.24) v1(57.27,63.61) v1(57.35,64.74) v1(57.48,71.53) v1(57.78,64.12) v1(57.86,65.25) v1(58.12,72.17) v1(58.29,64.63) v1(58.37,65.76) v1(58.75,72.8) v1(58.8,65.14) v1(59.32,37.23) v1(59.51,73.56) v1(59.73,41.9) v1(59.83,36.72) v1(60.22,35.27) v1(60.4,74.83) v1(60.34,36.21) v1(60.85,35.7) v1(60.85,34.69) v1(60.91,75.34) v1(60.97,52.94) v1(60.96,52.05) v1(61.35,51.55) v1(61.36,34.19) v1(61.42,75.85) v1(61.48,53.42) v1(61.48,52.58) v1(61.47,35.12) v1(61.86,52.06) v1(61.87,33.68) v1(61.93,76.36) v1(61.97,53.01) v1(61.98,34.61) v1(62.37,52.44) v1(62.38,33.17) v1(62.43,76.87) v1(62.49,34.1) v1(62.94,77.37) v1(63,33.6) v1(63.45,77.88) v1(63.53,31.97) v1(63.64,32.91) v1(63.96,78.39) v1(64.03,31.46) v1(64.15,32.4) v1(64.47,78.9) v1(64.54,30.96) v1(64.97,79.41) v1(65.08,30.36) v1(65.48,79.91) v1(65.58,29.85) v1(65.7,30.78) v1(65.86,75.79) v1(66.09,29.34) v1(66.21,30.28) v1(66.5,76.42) v1(66.6,28.83) v1(66.71,29.77) v1(66.82,10.19) v1(67.13,77.06) v1(67.22,29.26) v1(67.4,78.61) v1(67.45,9.56) v1(67.77,77.69) v1(68.02,79.22) v1(68.09,8.92) v1(68.4,78.33) v1(68.72,8.29) v1(69.36,7.65) v1(69.64,8.65) v1(70.24,8.03) v1(71.84,70.33) v1(72.4,15.78) v1(72.47,70.97) v1(73.04,30.13) v1(73.04,15.14) v1(73.11,71.6) v1(73.38,73.16) v1(73.67,14.51) v1(73.74,72.24) v1(73.8,29.37) v1(74,73.76) v1(74.38,72.87) v1(74.31,13.87) v1(74.44,28.73) v1(74.94,13.24) v1(75.07,27.97) v1(75.23,14.24) v1(75.71,27.34) v1(75.83,13.62) v1(76.79,26.32) v1(77.29,64.61) v1(77.29,25.81) v1(77.8,25.3) v1(77.93,65.25) v1(78.12,21.49) v1(78.31,24.8) v1(78.56,65.88) v1(78.75,20.86) v1(78.83,67.44) v1(78.82,24.29) v1(79.2,66.52) v1(79.33,23.78) v1(79.39,20.22) v1(79.45,68.04) v1(79.83,67.15) v1(79.83,23.27) v1(80.02,19.59) v1(80.34,22.76) v1(80.66,18.95) v1(80.85,22.26) v1(80.94,19.95) v1(81.36,21.75) v1(81.55,19.34) v1(81.87,21.24)
VCCBAT: length 30.3
  Top Layer w0.254: 63.58,64.42 61.67,62.52 61.67,61.25 R87.1 ; R62.1 65.08,25.58 66.88,23.78 ; 23.95,19.08 25.88,21.01 R37.1 ; R12.1 21.29,58.45 20.37,58.45 19,59.82 19,61.18 Q3.5
  Bottom Layer w0.762: 43.59,56.03 49.3,56.03 F4.1 ; 43.59,56.03 F2.1 ; 43.59,56.03 43.61,56.04 C82.1
  vias: v1(14.68,60.86) v1(15.44,60.23) v1(20.14,66.07) v1(20.91,65.49) v1(25.6,71.28) v1(26.25,70.75) v1(62.82,67.6) v1(63.7,68.36) v1(68.28,62.01) v1(69.04,62.77) v1(73.74,56.67) v1(74.37,57.44)
ABMF1: length 38.7
  Top Layer w0.254: v1(21.54,53.63) 23.06,52.1 26.68,52.1 U1.22
  地层 w0.254: v1(20.78,72.8) 19.51,72.8 13.54,66.83 13.54,64.8 16.08,62.26 16.08,59.09 v1(21.54,53.63)
  Bottom Layer w0.254: 21.77,72.37 R3.1 ; 21.77,72.37 21.82,72.37 R4.1 ; 21.77,72.37 R5.2 21.81,74.34
ABMF2: length 38.2
  Top Layer w0.254: U6.22 32.21,28.29 32.21,23.91 v1(30.05,21.75)
  地层 w0.254: v1(11.63,21.11) 11.63,20.1 16.84,14.89 18.75,14.89 19.76,15.91 24.21,15.91 v1(30.05,21.75)
  Bottom Layer w0.254: C42.2 11.08,21.16 R30.2 11.19,21.11 v1(11.63,21.11) 12.12,21.6 R28.1 R29.1
ABMF3: length 38.8
  Top Layer w0.254: v1(64.85,28.73) 61.67,31.91 57.29,31.91 U10.22
  地层 w0.254: v1(64.85,28.73) 69.93,23.65 69.93,20.86 71.39,19.4 71.39,17.24 65.23,11.08 v1(64.21,11.08)
  Bottom Layer w0.254: R54.1 R53.1 64.12,10.67 R55.2 63.18,9.67 C72.2
ABMF4: length 37.8
  Top Layer w0.254: v1(57.86,61.5) 56.21,59.85 56.21,54.96 U14.22
  地层 w0.254: v1(57.86,61.5) 63.58,67.21 67.64,67.21 68.91,68.48 70.7,68.48 76.28,62.91 v1(76.28,62.13)
  Bottom Layer w0.254: R79.1 76.42,60.39 R78.1 76.38,62.36 R80.2 76.43,62.36 C102.2
BATADC1: length 7.4
  Top Layer w0.254: C9.2 22.45,57.38 R13.2 22.71,57.71 22.71,59.85 22.96,60.1 24.96,60.1 25.58,59.48
BATADC2: length 7.5
  Top Layer w0.254: 25.33,26.68 24.59,25.93 24.59,23.91 R37.2 26.98,23.68 ; C45.2 27.3,23.68 26.98,23.68 ; 26.98,23.68 R38.2
BATADC3: length 7.4
  Top Layer w0.254: 58.9,25.03 59.42,24.52 R62.2 61.9,26.68 R63.2 61.05,28.04 61.05,28.11
BATADC4: length 8
  Top Layer w0.254: 63.21,56.44 63.96,57.19 63.96,57.56 63.09,58.43 R87.2 62.97,59.95 R88.2 60.74,59.95 C105.2
BBMF1: length 28.1
  Top Layer w0.254: v1(21.29,54.77) 23.32,52.74 26.61,52.74 28.05,54.18
  地层 w0.254: v1(21.29,54.77) 16.59,59.47 16.59,63.79 14.81,65.56 14.81,66.83 v1(15.44,67.47)
  Bottom Layer w0.254: 16.47,69.01 R8.2 16.44,67.03 ; 16.44,67.03 R6.1 ; 16.44,67.03 17.4,68 R7.1
BBMF2: length 27.6
  Top Layer w0.254: v1(29.16,21.75) 31.7,24.29 31.7,28.09 U6.21
  地层 w0.254: v1(29.16,21.75) 23.95,16.54 18.11,16.54 v1(17.22,15.65)
  Bottom Layer w0.254: R32.1 R31.1 16.74,15.68 R33.2 16.67,15.68 C43.2
BBMF3: length 28.5
  Top Layer w0.254: U10.21 57.49,31.4 61.29,31.4 v1(63.96,28.73)
  地层 w0.254: v1(69.67,16.41) 70.05,16.8 70.05,20.1 69.42,20.73 69.42,23.27 v1(63.96,28.73)
  Bottom Layer w0.254: R57.1 68.8,17.02 69.06,17.02 v1(69.67,16.41) 69.78,16.31 R58.2 68.78,15.01 C73.2
BBMF4: length 27.6
  Top Layer w0.254: v1(57.99,60.74) 56.72,59.47 56.72,55.16 U14.21
  地层 w0.254: 70.69,67.6 69.8,66.71 63.96,66.71 v1(57.99,60.74)
  Bottom Layer w0.254: R82.1 69.95,66.84 R81.1 70.92,67.82 R83.2 71.96,66.83 C103.2
  vias: v1(70.73,67.63)
CBMF1: length 22.2
  Top Layer w0.254: U1.15 25.03,55.4 v1(24.72,55.4)
  Bottom Layer w0.254: 10.97,61.57 11.94,62.54 R10.1 12.85,63.4 14.68,63.4 22.68,55.4 v1(24.72,55.4) ; 10.97,61.57 R9.1 ; 10.97,61.57 R11.2 ; 10.01,62.54 C8.2
CBMF2: length 23.1
  Top Layer w0.254: v1(29.54,24.92) 29.54,26 U6.15
  Bottom Layer w0.254: 23.37,11.06 R34.1 ; 23.37,11.06 22.4,12.02 R35.1 21.79,12.68 21.79,17.18 v1(29.54,24.92) ; 23.37,11.06 R36.2 22.4,10.09 C44.2
CBMF3: length 23.4
  Top Layer w0.254: v1(60.4,29.24) 59.58,29.24 U10.15
  Bottom Layer w0.254: C74.2 74.36,20.45 R61.2 75.17,21.44 74.32,22.28 ; 74.32,22.28 R59.1 ; 74.32,22.28 R60.1 72.64,20.61 70.56,20.61 65.36,25.81 63.7,25.81 60.4,29.11 v1(60.4,29.24)
CBMF4: length 23.2
  Top Layer w0.254: v1(59.39,57.44) 59.39,56.74 U14.15
  Bottom Layer w0.254: v1(59.39,57.44) 60.15,58.2 60.97,58.2 62.05,59.28 62.05,64.93 65.99,68.87 65.99,70.82 R85.1 R84.1 65.46,73.29 R86.2 66.5,72.29 C104.2
CLK1: length 10.2
  Top Layer w0.254: 42.86,65.06 41.08,63.28 39.27,63.28 U1.37
CLK2: length 7
  Top Layer w0.254: U6.37 24.54,37.37 21.67,37.37 21.35,37.06 19.3,37.06
CLK3: length 9.2
  Top Layer w0.254: 43.51,18.57 47.83,22.89 47.83,23.86 U10.37
CLK4: length 5.6
  Top Layer w0.254: 67.6,44.79 64.96,44.79 U14.37
CMPO1: length 3
  Top Layer w0.254: 25.58,56.66 U1.13 25.73,57.51 25.73,58.63 U1.12
CMPO2: length 3.1
  Top Layer w0.254: 28.16,26.68 U6.13 27.18,26.96 26.32,26.96 U6.12
CMPO3: length 3.1
  Top Layer w0.254: U10.12 58.62,26.02 58.62,26.88 U10.13 58.9,27.86
CMPO4: length 3.1
  Top Layer w0.254: U14.12 62.23,56.17 61.37,56.17 U14.13 60.39,56.44
DIO1: length 18
  Top Layer w0.254: U1.34 35.57,55.15 37.03,55.15 44.53,62.64 45.42,62.64 47.83,65.06 47.86,65.06
DIO2: length 10
  Top Layer w0.254: 22.51,40.89 22.55,40.93 24.08,40.93 26.62,38.39 27.64,38.39 29.16,36.86 29.16,36.16 U6.34
DIO3: length 16.1
  Top Layer w0.254: U10.34 49.42,28.86 48.59,28.86 38.69,18.95 38.69,18.57
DIO4: length 9.6
  Top Layer w0.254: U14.34 59.26,46.83 59.26,45.24 63.54,40.96 64.38,40.96
ERR1: length 4
  Top Layer w0.254: 32.3,61.96 33.22,62.88 v1(33.22,64.43)
  Bottom Layer w0.254: 33.22,64.42 32.49,64.42 32.17,64.09
ERR2: length 2.9
  Top Layer w0.254: v1(20.4,33.81) 20.68,34.09 22.16,34.09 U6.45
ERR3: length 3
  Top Layer w0.254: v1(51.64,20.22) 51.13,20.73 51.13,21.5 U10.45
ERR4: length 2.9
  Top Layer w0.254: v1(68.15,49.31) 67.87,49.03 66.39,49.03 U14.45
FB1: length 10.8
  Bottom Layer w0.305: v1(31.07,46.27) 30.18,47.16 30.18,49.69 31.4,50.91 U3.5
  Bottom Layer w0.406: v1(31.07,46.27) 31.07,45.57 R18.1
FB2: length 5.1
  Bottom Layer w0.406: 45.54,47.12 45.54,45.24 45.15,44.85 R68.1 R69.2
HOA1: length 14.8
  地层 w0.254: v1(21.79,70.26) 22.81,70.26 30.56,62.52 v1(30.56,61.12)
  Bottom Layer w0.254: U5.19 30.56,60.47 v1(30.56,61.12)
HOA2: length 14.4
  地层 w0.254: v1(23.7,30.89) 19.25,26.45 v1(19,26.45)
  Bottom Layer w0.254: v1(19,26.45) 14.66,22.11 14.27,22.11 ; U9.19 24.52,31.3 24.11,31.3 v1(23.7,30.89)
HOA3: length 14.6
  地层 w0.254: v1(54.69,23.53) 63.2,15.02 63.2,13.75
  Bottom Layer w0.254: U13.19 54.18,24.17 54.18,24.03 v1(54.69,23.53)
  vias: v1(63.17,13.64)
HOA4: length 15.6
  地层 w0.254: v1(64.85,51.59) 65.36,51.59 69.55,55.78 v1(69.55,56.29)
  Bottom Layer w0.254: U17.19 64.07,51.59 v1(64.85,51.59) ; R95.2 72.25,61.28 69.55,58.58 v1(69.55,56.29)
HOB1: length 15.8
  地层 w0.254: v1(27.76,59.98) 27.13,59.34 20.46,59.34 17.22,62.58 17.22,64.17 v1(16.46,64.93)
  Bottom Layer w0.254: U5.16 27.76,59.82 v1(27.76,59.98)
HOB2: length 15.1
  地层 w0.254: v1(24.84,28.86) 23.19,27.21 v1(23.19,21.37)
  Bottom Layer w0.254: U9.16 24.93,28.86 v1(24.84,28.86) ; v1(23.19,21.37) 23.19,20.48 19.79,17.07 19.79,16.69
HOB3: length 15.8
  地层 w0.254: v1(56.72,24.54) 64.47,24.54 68.66,20.35 v1(68.66,19.08)
  Bottom Layer w0.254: v1(56.72,24.54) 56.72,24.57 U13.16
HOB4: length 17.2
  地层 w0.254: v1(63.96,62.39) 65.23,61.12 65.23,55.78 v1(63.7,54.26)
  Bottom Layer w0.254: R97.2 66.94,66.77 63.58,63.4 63.58,62.77 v1(63.96,62.39) ; U17.16 63.55,54.26 v1(63.7,54.26)
HOC1: length 18
  地层 w0.254: v1(20.14,57.05) 21.16,58.07 v1(26.37,58.07)
  Bottom Layer w0.254: v1(20.14,57.05) 13.41,57.05 R24.2 ; v1(26.37,58.07) 26.75,58.45 27.01,58.45 U5.13
HOC2: length 19.7
  地层 w0.254: v1(27,25.81) 27,21.49 v1(26.75,21.24)
  Bottom Layer w0.254: R49.2 27.89,13.49 27.89,15.91 26.75,17.05 v1(26.75,21.24) ; 26.54,28.35 25.73,27.54 25.73,27.08 v1(27,25.81)
HOC3: length 18.6
  地层 w0.254: v1(64.59,26.45) 59.26,26.45 58.75,25.94 v1(57.86,25.94)
  Bottom Layer w0.254: v1(64.59,26.45) 72.72,26.45 74.29,24.88 R74.2 ; v1(57.86,25.94) 57.47,25.94 U13.13
HOC4: length 19.9
  地层 w0.254: v1(62.18,55.53) 62.18,55.89 60.78,57.29 v1(60.78,58.83)
  Bottom Layer w0.254: U17.13 62.18,55.01 v1(62.18,55.53) ; v1(60.78,58.83) 61.42,59.47 61.42,65.47 60.28,66.62 60.28,70.14 R99.2
LOA1: length 19.5
  Bottom Layer w0.254: U5.11 27.21,56.42 24.59,56.42 21.41,59.59 21.41,62.13 23.7,64.42 23.7,66.33 R21.2
LOA2: length 19.8
  Bottom Layer w0.254: R46.2 17.86,23.78 20.91,23.78 22.3,22.38 25.15,22.38 28.78,26.01 28.78,27.75 U9.11
LOA3: length 19.5
  Bottom Layer w0.254: R71.2 62.05,16.8 62.05,19.59 63.83,21.37 63.83,23.15 58.75,28.23 57.53,28.23 U13.11
LOA4: length 17.2
  Bottom Layer w0.254: R96.2 70.31,60.1 63.58,60.1 62.94,59.47 62.94,58.96 60.02,56.04 60.02,54.94 U17.11
LOB1: length 16
  Bottom Layer w0.254: 28.02,56.52 27.54,56.04 23.83,56.04 15.98,63.89 R23.2
LOB2: length 17.4
  Bottom Layer w0.254: R48.2 20.8,17.07 29.29,25.56 29.29,27.95 U9.10
LOB3: length 17.2
  Bottom Layer w0.254: U13.10 57.33,28.73 60.11,28.73 68.85,19.99 R73.2
LOB4: length 17.2
  Bottom Layer w0.254: R98.2 62.56,63.28 62.56,59.21 59.39,56.04 59.39,54.87 U17.10
LOC1: length 20.4
  Bottom Layer w0.254: R25.2 12.02,56.42 20.52,56.42 22.12,54.82 27.02,54.82 U5.9
LOC2: length 22.5
  Bottom Layer w0.254: R50.2 26.52,11.23 28.53,13.25 28.53,16.15 27.38,17.3 27.38,21.88 30.18,24.67 30.18,27.77 U9.9
LOC3: length 21.6
  Bottom Layer w0.254: U13.9 57.71,29.83 60.64,29.83 63.26,27.21 73.36,27.21 R75.2
LOC4: length 22.5
  Bottom Layer w0.254: R100.2 59.64,71.53 59.64,66.45 60.91,65.18 60.91,59.85 58.5,57.44 58.5,55.05 U17.9
MID1: length 38.6
  Top Layer w0.254: U1.27 32.3,54.18 31.19,55.29 31.19,59.34 v1(29.8,60.74)
  电源层 w0.254: 18.03,67.39 13.79,63.15 v1(13.79,62.64) ; 18.03,67.39 23.19,72.55 v1(23.95,72.55) ; 18.03,67.39 18.06,67.39 v1(18.55,66.91)
  地层 w0.254: v1(29.8,60.74) 25.99,64.55 25.35,64.55 22.99,66.91 v1(18.55,66.91)
  Bottom Layer w0.305: v1(13.79,62.64) 13.79,62.21 R10.2
MID2: length 41.5
  Top Layer w0.254: v1(24.21,32.92) 24.21,32.67 24.72,32.16 29.41,32.16 30.64,33.39 U6.27
  电源层 w0.254: 17.3,18.24 12.17,23.37 v1(12.17,24.19) ; 17.3,18.24 17.3,18.27 v1(17.75,18.72) ; 17.3,18.24 21.79,13.75 v1(22.51,13.75)
  地层 w0.254: v1(12.17,24.19) 12.17,25.46 19.89,33.18 23.95,33.18 v1(24.21,32.92)
  Bottom Layer w0.305: v1(22.51,13.75) 22.86,13.75 R35.2
MID3: length 41.1
  Top Layer w0.254: U10.27 U10.28 53.42,29.1 53.42,23.91 v1(53.8,23.53)
  电源层 w0.254: 67.17,16.58 62.28,11.69 v1(61.2,11.69) ; 67.17,16.58 71.3,20.71 v1(71.3,21.39) ; 67.17,16.58 67.17,16.61 v1(66.71,17.06)
  地层 w0.254: v1(53.8,23.53) 54.81,22.51 54.81,15.4 58.5,11.72 61.17,11.72 v1(61.2,11.69)
  Bottom Layer w0.305: R60.2 v1(71.3,21.39)
MID4: length 39.3
  Top Layer w0.254: U14.27 U14.28 58.76,50.58 62.56,50.58 v1(64.34,52.36)
  电源层 w0.254: v1(75.36,59.3) 75.36,60.51 70.48,65.39 ; 70.48,65.39 70.48,65.38 v1(69.88,64.78) ; 70.48,65.39 70.07,65.8 ; v1(65.3,69.45) 66.43,69.45 70.06,65.81
  地层 w0.254: v1(64.34,52.36) 71.76,59.77 74.83,59.77 75.3,59.3 v1(75.36,59.3)
  Bottom Layer w0.305: v1(65.3,69.45) 65.23,69.45 R85.2
NRST1: length 4.5
  Top Layer w0.254: R2.1 27.08,64.52 C5.2 25.97,61.92 26.99,60.9
NRST2: length 4.6
  Top Layer w0.254: R26.1 20.17,28.3 C40.2 23.02,27.2 23.92,28.09
NRST3: length 4.6
  Top Layer w0.254: 57.49,23.62 58.38,22.73 C70.2 57.27,19.87 R51.1
NRST4: length 4.2
  Top Layer w0.254: 64.63,55.03 65.78,56.18 C100.2 67.88,55.07 R76.1
P1: length 27.7
  电源层 w0.254: v1(37.29,56.42) 42.37,51.34 42.37,36.17 CN2.1
  Bottom Layer w0.254: R101.2 37.29,56.55 v1(37.29,56.42)
P2: length 18
  电源层 w0.254: CN2.2 40.1,31.4 36.53,31.4 v1(30.94,36.99)
  Bottom Layer w0.254: R102.2 28.14,38.26 29.67,38.26 v1(30.94,36.99)
P3: length 7
  Bottom Layer w0.254: R103.2 44.25,30.53 CN2.3
P4: length 19.5
  电源层 w0.254: v1(60.78,44.61) 49.23,33.05 CN2.4
  Bottom Layer w0.254: R104.2 60.89,44.71 v1(60.78,44.61)
PWMAH1: length 7.2
  Top Layer w0.254: U1.29 31.7,55.49 v1(31.7,59.98)
  Bottom Layer w0.254: v1(31.7,59.98) 31.7,59.49 U5.22
PWMAH2: length 7.1
  Top Layer w0.254: U6.29 29.08,32.54 25.22,32.54 v1(24.97,32.8)
  Bottom Layer w0.254: 25.84,32.11 25.15,32.8 v1(24.97,32.8)
PWMAH3: length 6.7
  Top Layer w0.254: v1(52.78,24.8) 52.91,24.92 52.91,28.9 U10.29
  Bottom Layer w0.254: 53.42,25.53 52.78,24.9 v1(52.78,24.8)
PWMAH4: length 7.4
  Top Layer w0.254: v1(63.45,49.69) 62.94,50.2 59.09,50.2 U14.29
  Bottom Layer w0.254: v1(63.45,49.69) 63.45,50.1 62.59,50.96
PWMAL1: length 14.1
  Top Layer w0.254: 26.64,55.6 25.1,54.05 v1(25.1,53.63)
  Bottom Layer w0.254: U5.1 32.21,56.79 32.21,54.37 30.2,52.36 26.37,52.36 v1(25.1,53.63)
PWMAL2: length 14.2
  Top Layer w0.254: v1(30.81,26.32) 30.64,26.32 U6.17
  Bottom Layer w0.254: U9.1 27.96,33.31 30.3,33.31 32.59,31.02 32.59,27.59 31.32,26.32 v1(30.81,26.32)
PWMAL3: length 14.6
  Top Layer w0.254: v1(59.39,30.64) 59.39,30.47 U10.17
  Bottom Layer w0.254: v1(59.39,30.64) 59.39,30.89 58.12,32.16 54.05,32.16 52.02,30.13 52.02,27.85 U13.1
PWMAL4: length 14.1
  Top Layer w0.254: v1(57.74,56.8) 57.91,56.8 U14.17
  Bottom Layer w0.254: v1(57.74,56.8) 57.38,56.8 56.08,55.51 56.08,51.6 57.87,49.82 60.52,49.82 U17.1
PWMBH1: length 6
  Top Layer w0.254: U1.30 32.34,55.56 v1(32.34,59.34)
  Bottom Layer w0.254: v1(32.34,59.34) 32.25,59.34 U5.23
PWMBH2: length 6.3
  Top Layer w0.254: v1(25.48,33.43) 25.86,33.05 28.88,33.05 U6.30
  Bottom Layer w0.254: v1(25.48,33.43) 25.48,33.18 U9.23
PWMBH3: length 6.1
  Top Layer w0.254: v1(52.02,25.3) 52.4,25.69 52.4,28.71 51.48,29.63
  Bottom Layer w0.254: U13.23 52.48,25.3 v1(52.02,25.3)
PWMBH4: length 6.5
  Top Layer w0.254: v1(62.82,49.18) 62.18,49.82 59.41,49.82 U14.30
  Bottom Layer w0.254: v1(62.82,49.18) 62.82,50.02 U17.23
PWMBL1: length 11.7
  Top Layer w0.254: 26.99,55.24 25.86,54.11 v1(25.86,53.88)
  Bottom Layer w0.254: v1(25.86,53.88) 25.86,53.63 26.75,52.74 30.07,52.74 31.83,54.49 31.83,56.46 U5.2
PWMBL2: length 11.7
  Top Layer w0.254: 29.58,28.09 30.58,27.08 v1(30.94,27.08)
  Bottom Layer w0.254: U9.2 28.29,32.92 30.18,32.92 32.21,30.89 32.21,27.99 31.3,27.08 v1(30.94,27.08)
PWMBL3: length 12.1
  Top Layer w0.254: 57.49,29.28 58.62,30.41 v1(58.62,30.64)
  Bottom Layer w0.254: U13.2 52.4,28.18 52.4,29.88 54.3,31.78 57.74,31.78 58.62,30.89 v1(58.62,30.64)
PWMBL4: length 11.5
  Top Layer w0.254: 58.97,55.03 57.96,56.04 v1(57.61,56.04)
  Bottom Layer w0.254: U17.2 60.19,50.2 58.12,50.2 56.59,51.72 56.59,55.28 57.35,56.04 v1(57.61,56.04)
PWMCH1: length 5.2
  Top Layer w0.254: v1(32.97,58.71) 32.84,58.58 32.84,55.76 U1.31
  Bottom Layer w0.254: v1(32.97,58.71) 32.32,58.71 U5.24
PWMCH2: length 5.3
  Top Layer w0.254: v1(26.11,33.94) 26.49,33.56 28.68,33.56 U6.31
  Bottom Layer w0.254: v1(26.11,33.94) 26.11,33.25 U9.24
PWMCH3: length 4.8
  Top Layer w0.254: v1(51.64,26.07) 51.89,26.32 51.89,28.51 U10.31
  Bottom Layer w0.254: v1(51.64,26.07) 52.54,26.07 U13.24
